# Altium schematic sheet AMU-S17-V00-BSPDWindowComparitor.SchDoc: Window Comparitor
size A3; DrawnBy: Jonn Dillon; DocumentNumber: 3; Revision: 01; SheetNumber: 15; SheetTotal: 25
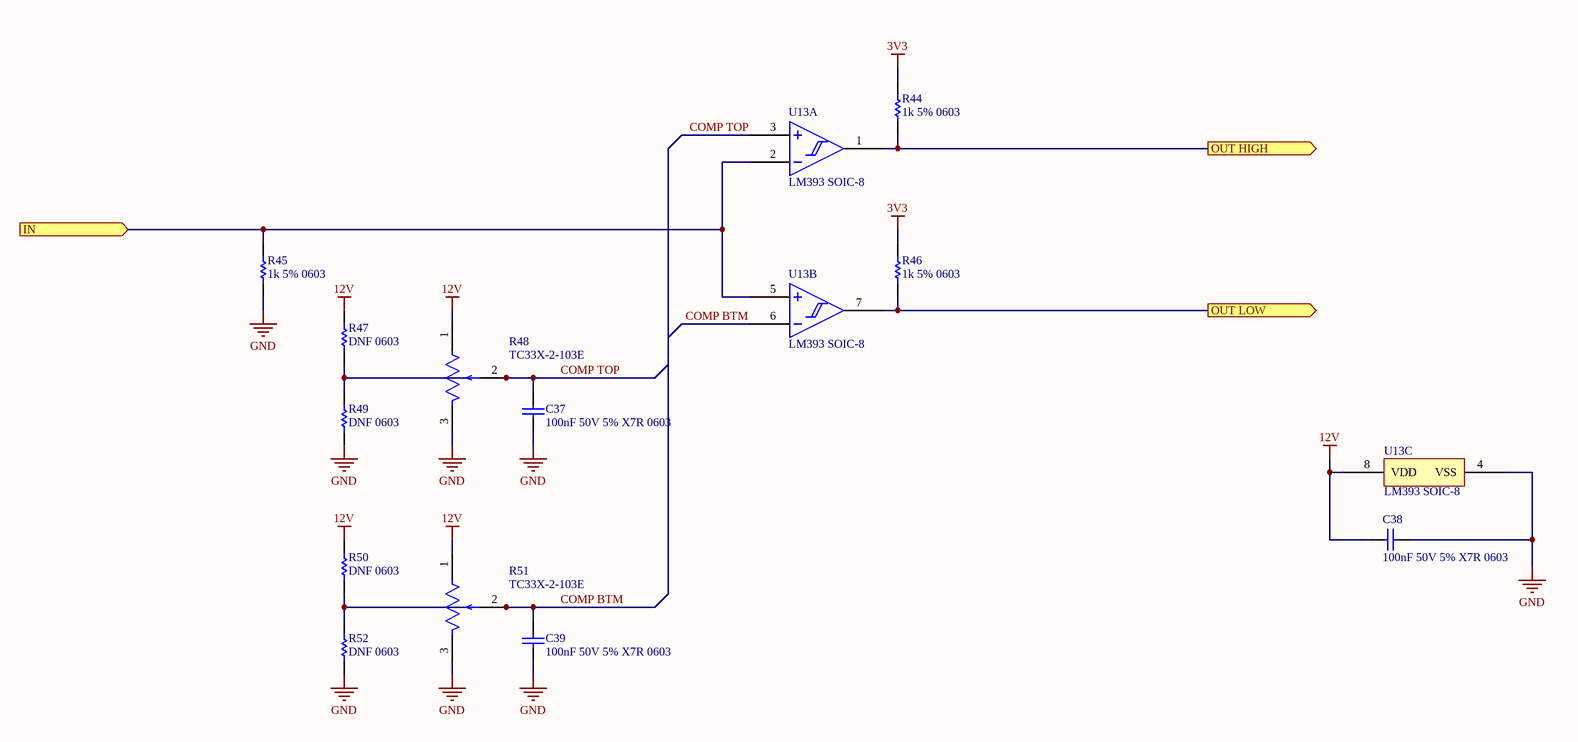
[diagram p0: AMU-S17-V00-BSPDWindowComparitor.SchDoc]

## Parts
C37  100nF 50V 5% X7R 0603  [Cap_Ceramic_0603]
C38  100nF 50V 5% X7R 0603  [Cap_Ceramic_0603]
C39  100nF 50V 5% X7R 0603  [Cap_Ceramic_0603]
R44  1k 5% 0603  [Res_ThinFilm_0603]
R45  1k 5% 0603  [Res_ThinFilm_0603]
R46  1k 5% 0603  [Res_ThinFilm_0603]
R47  DNF 0603  [Res_ThinFilm_0603]
R48  TC33X-2-103E  [TC33]
R49  DNF 0603  [Res_ThinFilm_0603]
R50  DNF 0603  [Res_ThinFilm_0603]
R51  TC33X-2-103E  [TC33]
R52  DNF 0603  [Res_ThinFilm_0603]
U13  LM393 SOIC-8  [SOIC-8]  (parts A,B,C of 3)

## Ports
IN (in), OUT HIGH (out), OUT LOW (out)

## Nets
3V3: R44.2 R46.2
12V: C38.1 R47.2 R48.1 R50.2 R51.1 U13.8(VDD)
GND: C37.1 C38.2 C39.1 R45.1 R48.3 R49.1 R51.3 R52.1 U13.4(VSS)
COMP BTM: C39.2 R50.1 R51.2 R52.2 U13.6(IN2-)
COMP TOP: C37.2 R47.1 R48.2 R49.2 U13.3(IN1+)
IN: R45.2 U13.2(IN1-) U13.5(IN2+) ; port IN
OUT HIGH: R44.1 U13.1(OUT1) ; port OUT HIGH
OUT LOW: R46.1 U13.7(OUT1) ; port OUT LOW

## Notes on the sheet
- Revision History:
- Sheet Title:
- Rev
- Date
- Description
- Project:
- Size:
- Drawn By:
- A3
- Number:
- Revision:
- Sheet
- Version:
- of
- QUT Motorsport
- O-120, Gardens Point
- 2 George Street
- Brisbane, QLD 4000
- Australia
- Print Date:
- Print Time:
- File Name:

## Library data of the parts
C37-C39 = 100nF 50V 5% X7R 0603: Capacitor, Ceramic, SMD, 100nF, 50V, 5%, X7R, 0603
R44-R46 = 1k 5% 0603: Resistor, SMD, 1k, 0.1W, 5%, 0603
R47 R49 R50 R52 = DNF 0603: Resistor, SMD, DNF, 0.1W, 0603
R48 R51 = TC33X-2-103E: 10 kOhms 0.1W, 1/10W J Lead Surface Mount Trimmer Potentiometer Cermet 1 Turn Top Adjustment
U13 = LM393: General Purpose Comparitor 2 Circuit 8-SOIC